# Altium schematic sheet fpga_io_bank_1_PCIe.SchDoc: FPGA bank 1
size 209 x 297 mm; CheckedBy: MC, TW, EB; CompanyName: CERN; DrawnBy: Greg Kasprowicz; Organization: CERN; Address1: European Organization for Nuclear Research; Address2: CH-1211 Geneve 23 - Switzerland; DocumentNumber: 6; Revision: -; SheetNumber: 6; SheetTotal: 17; EDA_Number: EDA-02189-V4-0; Projet: Simple PCIe Carrier Board; ModifiedBy: TW, MC; CreateDate: 10/07/2010; CheckedDate: 11/05/2011; Title2: PCIe bridge connections; DivGrp: BE-CO; Designer: GK, MC, TW, EB, PAS; ModifiedDate: -
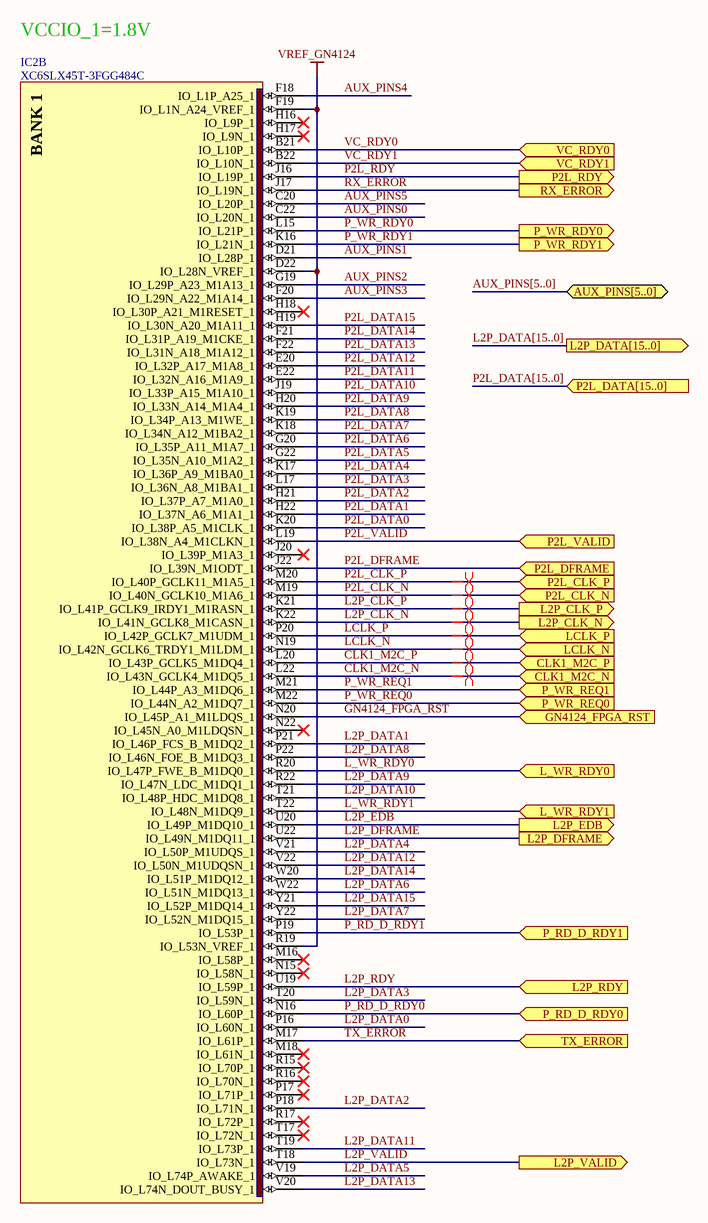
[diagram p0: fpga_io_bank_1_PCIe.SchDoc]

## Parts
IC2  XC6SLX45T-3FGG484C  [BGA484C100P22X22_2300X2300X260]  (part B of 9)

## Ports
AUX_PINS[5..0] (bidir), CLK1_M2C_N (in), CLK1_M2C_P (in), GN4124_FPGA_RST (in), L2P_CLK_N (out), L2P_CLK_P (out), L2P_DATA[15..0] (out), L2P_DFRAME (out), L2P_EDB (out), L2P_RDY (in), L2P_VALID (out), L_WR_RDY0 (in), L_WR_RDY1 (in), LCLK_N (in), LCLK_P (in), P2L_CLK_N (in), P2L_CLK_P (in), P2L_DATA[15..0] (in), P2L_DFRAME (in), P2L_RDY (out), P2L_VALID (in), P_RD_D_RDY0 (in), P_RD_D_RDY1 (in), P_WR_RDY0 (out), P_WR_RDY1 (out), P_WR_REQ0 (in), P_WR_REQ1 (in), RX_ERROR (out), TX_ERROR (in), VC_RDY0 (in), VC_RDY1 (in)

## Nets
VREF_GN4124: IC2.D22(IO_L28N_VREF_1) IC2.F19(IO_L1N_A24_VREF_1) IC2.R19(IO_L53N_VREF_1)
AUX_PINS0: IC2.C22(IO_L20N_1)
AUX_PINS1: IC2.D21(IO_L28P_1)
AUX_PINS2: IC2.G19(IO_L29P_A23_M1A13_1)
AUX_PINS3: IC2.F20(IO_L29N_A22_M1A14_1)
AUX_PINS4: IC2.F18(IO_L1P_A25_1)
AUX_PINS5: IC2.C20(IO_L20P_1)
CLK1_M2C_N: IC2.L22(IO_L43N_GCLK4_M1DQ5_1) ; port CLK1_M2C_N
CLK1_M2C_P: IC2.L20(IO_L43P_GCLK5_M1DQ4_1) ; port CLK1_M2C_P
GN4124_FPGA_RST: IC2.N20(IO_L45P_A1_M1LDQS_1) ; port GN4124_FPGA_RST
L2P_CLK_N: IC2.K22(IO_L41N_GCLK8_M1CASN_1) ; port L2P_CLK_N
L2P_CLK_P: IC2.K21(IO_L41P_GCLK9_IRDY1_M1RASN_1) ; port L2P_CLK_P
L2P_DATA0: IC2.P16(IO_L60N_1)
L2P_DATA1: IC2.P21(IO_L46P_FCS_B_M1DQ2_1)
L2P_DATA2: IC2.P18(IO_L71N_1)
L2P_DATA3: IC2.T20(IO_L59N_1)
L2P_DATA4: IC2.V21(IO_L50P_M1UDQS_1)
L2P_DATA5: IC2.V19(IO_L74P_AWAKE_1)
L2P_DATA6: IC2.W22(IO_L51N_M1DQ13_1)
L2P_DATA7: IC2.Y22(IO_L52N_M1DQ15_1)
L2P_DATA8: IC2.P22(IO_L46N_FOE_B_M1DQ3_1)
L2P_DATA9: IC2.R22(IO_L47N_LDC_M1DQ1_1)
L2P_DATA10: IC2.T21(IO_L48P_HDC_M1DQ8_1)
L2P_DATA11: IC2.T19(IO_L73P_1)
L2P_DATA12: IC2.V22(IO_L50N_M1UDQSN_1)
L2P_DATA13: IC2.V20(IO_L74N_DOUT_BUSY_1)
L2P_DATA14: IC2.W20(IO_L51P_M1DQ12_1)
L2P_DATA15: IC2.Y21(IO_L52P_M1DQ14_1)
L2P_DFRAME: IC2.U22(IO_L49N_M1DQ11_1) ; port L2P_DFRAME
L2P_EDB: IC2.U20(IO_L49P_M1DQ10_1) ; port L2P_EDB
L2P_RDY: IC2.U19(IO_L59P_1) ; port L2P_RDY
L2P_VALID: IC2.T18(IO_L73N_1) ; port L2P_VALID
L_WR_RDY0: IC2.R20(IO_L47P_FWE_B_M1DQ0_1) ; port L_WR_RDY0
L_WR_RDY1: IC2.T22(IO_L48N_M1DQ9_1) ; port L_WR_RDY1
LCLK_N: IC2.N19(IO_L42N_GCLK6_TRDY1_M1LDM_1) ; port LCLK_N
LCLK_P: IC2.P20(IO_L42P_GCLK7_M1UDM_1) ; port LCLK_P
P2L_CLK_N: IC2.M19(IO_L40N_GCLK10_M1A6_1) ; port P2L_CLK_N
P2L_CLK_P: IC2.M20(IO_L40P_GCLK11_M1A5_1) ; port P2L_CLK_P
P2L_DATA0: IC2.K20(IO_L38P_A5_M1CLK_1)
P2L_DATA1: IC2.H22(IO_L37N_A6_M1A1_1)
P2L_DATA2: IC2.H21(IO_L37P_A7_M1A0_1)
P2L_DATA3: IC2.L17(IO_L36N_A8_M1BA1_1)
P2L_DATA4: IC2.K17(IO_L36P_A9_M1BA0_1)
P2L_DATA5: IC2.G22(IO_L35N_A10_M1A2_1)
P2L_DATA6: IC2.G20(IO_L35P_A11_M1A7_1)
P2L_DATA7: IC2.K18(IO_L34N_A12_M1BA2_1)
P2L_DATA8: IC2.K19(IO_L34P_A13_M1WE_1)
P2L_DATA9: IC2.H20(IO_L33N_A14_M1A4_1)
P2L_DATA10: IC2.J19(IO_L33P_A15_M1A10_1)
P2L_DATA11: IC2.E22(IO_L32N_A16_M1A9_1)
P2L_DATA12: IC2.E20(IO_L32P_A17_M1A8_1)
P2L_DATA13: IC2.F22(IO_L31N_A18_M1A12_1)
P2L_DATA14: IC2.F21(IO_L31P_A19_M1CKE_1)
P2L_DATA15: IC2.H19(IO_L30N_A20_M1A11_1)
P2L_DFRAME: IC2.J22(IO_L39N_M1ODT_1) ; port P2L_DFRAME
P2L_RDY: IC2.J16(IO_L19P_1) ; port P2L_RDY
P2L_VALID: IC2.L19(IO_L38N_A4_M1CLKN_1) ; port P2L_VALID
P_RD_D_RDY0: IC2.N16(IO_L60P_1) ; port P_RD_D_RDY0
P_RD_D_RDY1: IC2.P19(IO_L53P_1) ; port P_RD_D_RDY1
P_WR_RDY0: IC2.L15(IO_L21P_1) ; port P_WR_RDY0
P_WR_RDY1: IC2.K16(IO_L21N_1) ; port P_WR_RDY1
P_WR_REQ0: IC2.M22(IO_L44N_A2_M1DQ7_1) ; port P_WR_REQ0
P_WR_REQ1: IC2.M21(IO_L44P_A3_M1DQ6_1) ; port P_WR_REQ1
RX_ERROR: IC2.J17(IO_L19N_1) ; port RX_ERROR
TX_ERROR: IC2.M17(IO_L61P_1) ; port TX_ERROR
VC_RDY0: IC2.B21(IO_L10P_1) ; port VC_RDY0
VC_RDY1: IC2.B22(IO_L10N_1) ; port VC_RDY1

Not connected (* = marked no-connect by the designer): IC2 H16(IO_L9P_1)* H17(IO_L9N_1)* H18(IO_L30P_A21_M1RESET_1)* J20(IO_L39P_M1A3_1)* M16(IO_L58P_1)* M18(IO_L61N_1)* N15(IO_L58N_1)* N22(IO_L45N_A0_M1LDQSN_1)* P17(IO_L71P_1)* R15(IO_L70P_1)* R16(IO_L70N_1)* R17(IO_L72P_1)* T17(IO_L72N_1)*

## Buses and harness runs
bus AUX_PINS[5..0] = port AUX_PINS[5..0]
bus L2P_DATA[15..0] = port L2P_DATA[15..0]
bus P2L_DATA[15..0] = port P2L_DATA[15..0]

## Layout directives
differential pair: CLK1_M2C_N, CLK1_M2C_P, L2P_CLK_N, L2P_CLK_P, LCLK_N, LCLK_P, P2L_CLK_N, P2L_CLK_P

## Notes on the sheet
- VCCIO_1=1.8V
- Project/Equipment
- Document
- Designer
- Drawn by
- Check.by
- File
- Last Mod.
- Print Date
- Sheet
- Size
- A4
- of
- Rev
- (in symbol XC6SLX45T-3FGG484C, part B) BANK 1

## Library data of the parts
IC2 = XC6SLX45T-3FGG484C: Spartan-6 LXT 1.2V FPGA, 296 User I/Os, 484-Ball Fine-Pitch BGA (1.0mm Pitch), Speed Grade 3, Commercial Grade, Pb-Free; Manufacturer: XILINX; Table: Logic; Part Number: XC6SLX45T-3FGG484C; Component Kind: Standard; Component Type: Standard; Device: XC6SLX45T-3FGG484C; PackageDescription: BGA,1.00mm pitch,square;484 pin,22 columns X 22 rows,23.00mm X 23.00mm X 2.60mm H; Part Description: Spartan-6 LXT 1.2V FPGA, 296 User I/Os, 484-Ball Fine-Pitch BGA (1.0mm Pitch), Speed Grade 3, Commercial Grade, Pb-Free; Manufacturer Part Number: XC6SLX45T-3FGG484C; Pin Count: 484; Case: BGA484; Mounted: Yes; Socket: No; SMD: Yes; ComponentHeight: 2.6mm; HelpURL: \\cern.ch\dfs\Applications\Altium\Datasheets\XC6SLX45T-3FGG484C.pdf; ComponentLink1URL: \\cern.ch\dfs\Applications\Altium\Datasheets\XC6SLX45T-3FGG484C_Package-Pinouts.pdf; ComponentLink1Description: Package/Pinouts; Author: CERN DEM JLC; CreateDate: 2010-07-08; LatestRevisionDate: 2010-07-08